# Altium project Step_Motor_Driver.PrjPcb
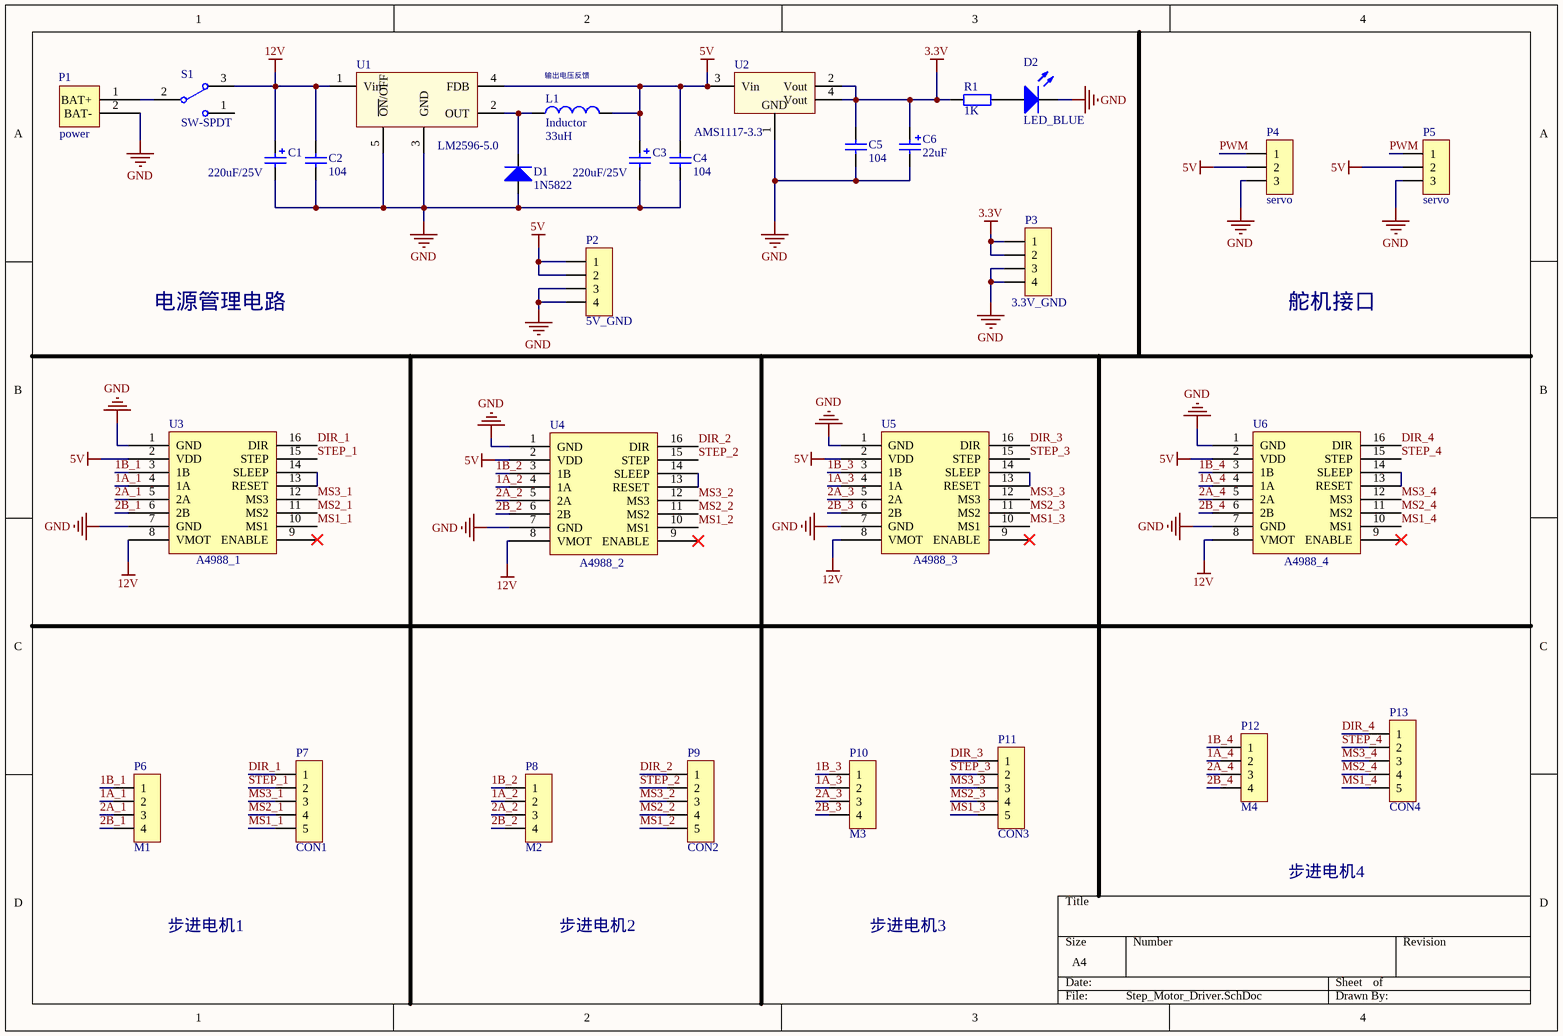
[diagram p0: Step_Motor_Driver.SchDoc]
1 sheet, 30 parts. Net scope: global (net labels, ports and power ports of the same name join across sheets).
Board file: Step_Motor_Driver.PcbDoc

## Sheet Step_Motor_Driver.SchDoc
size A4

### Parts
C1  220uF/25V  [CAP POL [25V]]
C2  Cap  [0805C]  (value not drawn)
C3  220uF/25V  [CAP POL [25V]]
C4  Cap  [0805C]  (value not drawn)
C5  Cap  [0805C]  (value not drawn)
C6  Cap Pol(22uF)  [CAP[1210]]  (value not drawn)
D1  1N5822  [SS34_3D]
D2  LED_BLUE  [0805LED1]
L1  Inductor  [Inductor_T10uH]
P1  power  [电源端子]
P2  5V_GND  [HDR2.54-LI-4P]
P3  3.3V_GND  [HDR2.54-LI-4P]
P4  servo  [HDR2.54-LI-3P]
P5  servo  [HDR2.54-LI-3P]
P6  M1  [HDR2.54-LI-4P]
P7  CON1  [HDR2.54-LI-5P]
P8  M2  [HDR2.54-LI-4P]
P9  CON2  [HDR2.54-LI-5P]
P10  M3  [HDR2.54-LI-4P]
P11  CON3  [HDR2.54-LI-5P]
P12  M4  [HDR2.54-LI-4P]
P13  CON4  [HDR2.54-LI-5P]
R1  Res2  [0805R]  (value not drawn)
S1  SW-SPDT  [SW-TO3]
U1  LM2596-5.0  [TO-263-5]
U2  AMS1117-3.3  [SOT-223]
U3  A4988_1  [A4988]
U4  A4988_2  [A4988]
U5  A4988_3  [A4988]
U6  A4988_4  [A4988]

### Nets
3.3V: C5.2 C6.1 P3.1 P3.2 R1.1 U2.2(Vout) U2.4(Vout)
5V: C3.1 C4.1 L1.2 P2.1 P2.2 P4.2 P5.2 U1.4(FDB) U2.3(Vin) U3.2(VDD) U4.2(VDD) U5.2(VDD) U6.2(VDD)
12V: C1.1 C2.1 S1.3 U1.1(Vin) U3.8(VMOT) U4.8(VMOT) U5.8(VMOT) U6.8(VMOT)
GND: C1.2 C2.2 C3.2 C4.2 C5.1 C6.2 D1.1 D2.2(K) P1.2(BAT-) P2.3 P2.4 P3.3 P3.4 P4.3 P5.3 U1.3(GND) U1.5(~{ON}/OFF) U2.1(GND) U3.1(GND) U3.7(GND) U4.1(GND) U4.7(GND) U5.1(GND) U5.7(GND) U6.1(GND) U6.7(GND)
1A_1: P6.2 U3.4(1A)
1A_2: P8.2 U4.4(1A)
1A_3: P10.2 U5.4(1A)
1A_4: P12.2 U6.4(1A)
1B_1: P6.1 U3.3(1B)
1B_2: P8.1 U4.3(1B)
1B_3: P10.1 U5.3(1B)
1B_4: P12.1 U6.3(1B)
2A_1: P6.3 U3.5(2A)
2A_2: P8.3 U4.5(2A)
2A_3: P10.3 U5.5(2A)
2A_4: P12.3 U6.5(2A)
2B_1: P6.4 U3.6(2B)
2B_2: P8.4 U4.6(2B)
2B_3: P10.4 U5.6(2B)
2B_4: P12.4 U6.6(2B)
DIR_1: P7.1 U3.16(DIR)
DIR_2: P9.1 U4.16(DIR)
DIR_3: P11.1 U5.16(DIR)
DIR_4: P13.1 U6.16(DIR)
MS1_1: P7.5 U3.10(MS1)
MS1_2: P9.5 U4.10(MS1)
MS1_3: P11.5 U5.10(MS1)
MS1_4: P13.5 U6.10(MS1)
MS2_1: P7.4 U3.11(MS2)
MS2_2: P9.4 U4.11(MS2)
MS2_3: P11.4 U5.11(MS2)
MS2_4: P13.4 U6.11(MS2)
MS3_1: P7.3 U3.12(MS3)
MS3_2: P9.3 U4.12(MS3)
MS3_3: P11.3 U5.12(MS3)
MS3_4: P13.3 U6.12(MS3)
PWM: P4.1 P5.1
STEP_1: P7.2 U3.15(STEP)
STEP_2: P9.2 U4.15(STEP)
STEP_3: P11.2 U5.15(STEP)
STEP_4: P13.2 U6.15(STEP)
NetD1_2: D1.2 L1.1 U1.2(OUT)
NetD2_1: D2.1(A) R1.2
NetP1_1: P1.1(BAT+) S1.2
NetU3_13: U3.13(RESET) U3.14(SLEEP)
NetU4_13: U4.13(RESET) U4.14(SLEEP)
NetU5_13: U5.13(RESET) U5.14(SLEEP)
NetU6_13: U6.13(RESET) U6.14(SLEEP)

Not connected (* = marked no-connect by the designer): S1 1; U3 9(ENABLE)*; U4 9(ENABLE)*; U5 9(ENABLE)*; U6 9(ENABLE)*

### Notes on the sheet
- (near L1) 输出电压反馈
- 电源管理电路
- 舵机接口
- 步进电机4
- 步进电机1
- 步进电机2
- 步进电机3
- (in symbol Cap Pol(22uF)) 22uF
- (in symbol Cap_1) 104
- (in symbol Inductor_1) 33uH
- (in symbol Res2) 1K

### Library data of the parts
C1 C3 = Cap Pol [220uF/35V]: 220uF/35V
C2 C4 C5 = Cap_1
D1 = 1N5819_1: 二极管
L1 = Inductor_1
P1 = POWER: 电源输入
P2 P3 P6 P8 P10 P12 = Header 4: 4P接插件; 版权归属: 源创客; BOM名称: 4P接插件; 学习资源: www.ooocke.com
P4 P5 = Header 3: 3P接插件; 版权归属: 源创客; BOM名称: 3P接插件; 学习资源: www.ooocke.com
P7 P9 P11 P13 = Header 5: 5P接插件; 版权归属: 源创客; BOM名称: 5P接插件; 学习资源: www.ooocke.com
S1 = SW-SPDT: SPDT Subminiature Toggle Switch, Right Angle Mounting, Vertical Actuation; Published: 24-Mar-1999; LatestRevisionDate: 17-Dec-2003; LatestRevisionNote: Schematic revised, PCB Footprint replaced.; DatasheetVersion: 05-Dec-2000; PackageReference: TL36WW15050; Publisher: Altium Limited; PackageDescription: Switch; 4 Leads; ComponentLink1Description: Manufacturer Link; ComponentLink1URL: http://www.apem.com
U1 = LM2596-5.0: IC
U3-U6 = A4988: A4988 Module